# EAGLE schematic main_circuit (EAGLE 9.5.1)
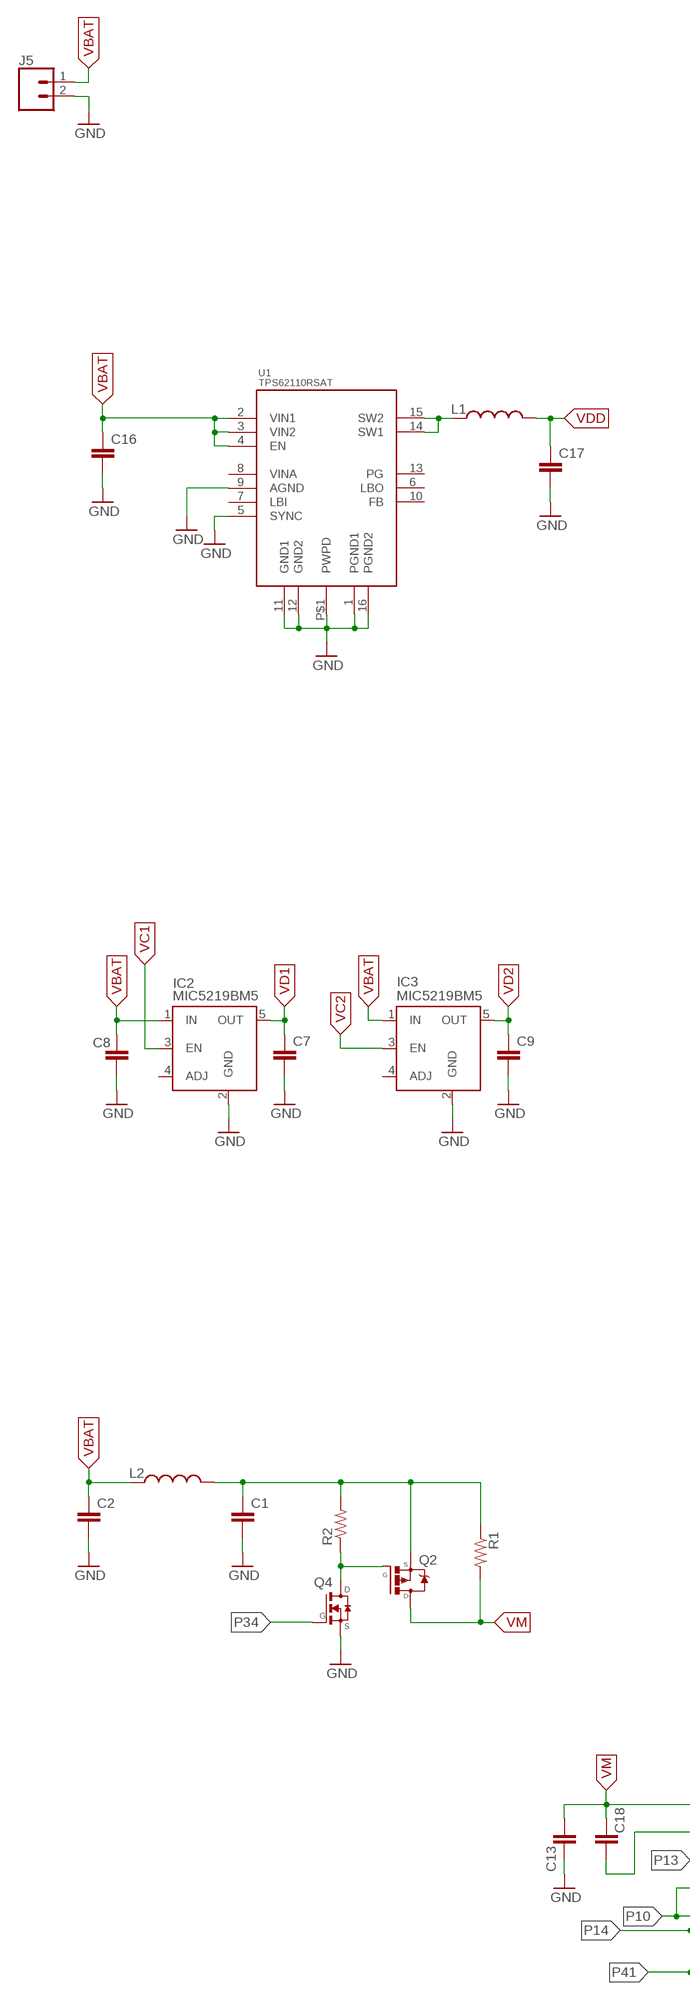
[diagram p0: schematic, sheet 1, part 1 of 2]
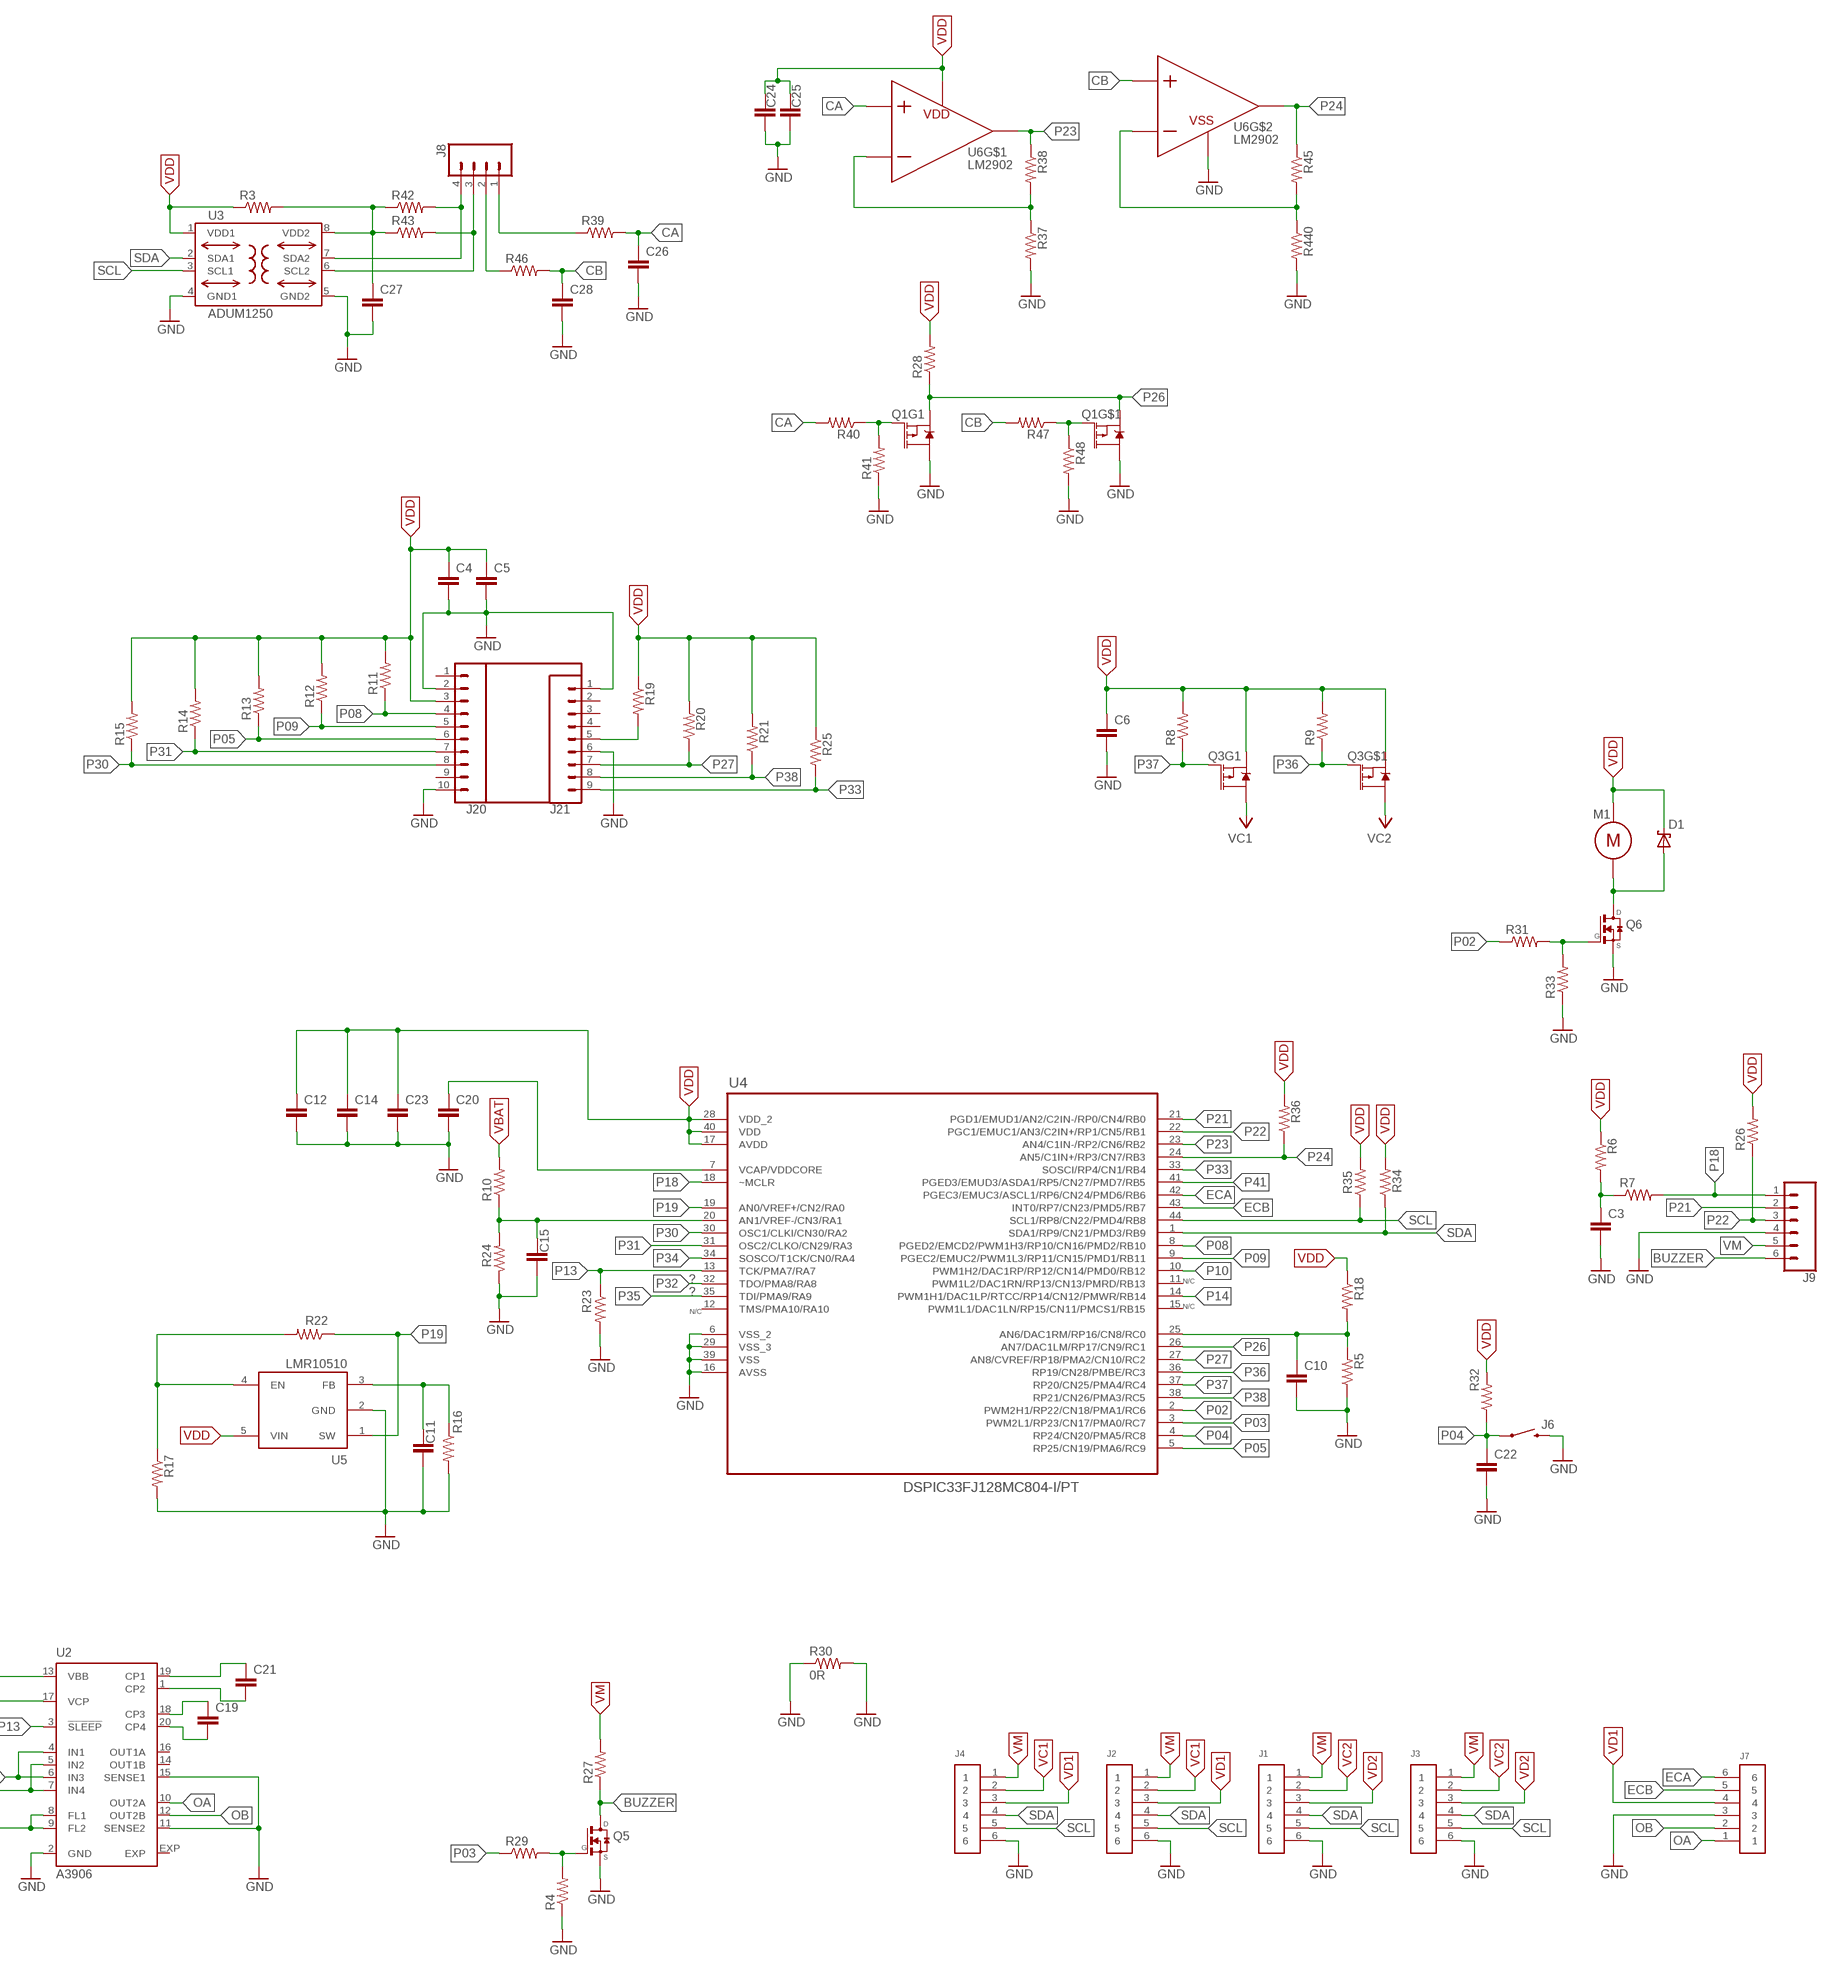
[diagram p1: schematic, sheet 1, part 2 of 2]

## Parts
C1  C-EUC0805  [C0805]
C2  C-EUC0805  [C0805]
C3  CAPACITOR_0805_M  [RESC0805_M]
C4  CAPACITOR_0805_M  [RESC0805_M]
C5  CAPACITOR_0805_M  [RESC0805_M]
C6  C-EUC0805  [C0805]
C7  CAPACITOR_0805_M  [RESC0805_M]
C8  CAPACITOR_0805_M  [RESC0805_M]
C9  CAPACITOR_0805_M  [RESC0805_M]
C10  CAPACITOR_0805_M  [RESC0805_M]
C11  CAPACITOR_0805_M  [RESC0805_M]
C12  CAPACITOR_0805_M  [RESC0805_M]
C13  CAPACITOR_0805_M  [RESC0805_M]
C14  CAPACITOR_0805_M  [RESC0805_M]
C15  CAPACITOR_0805_M  [RESC0805_M]
C16  CAPACITOR_0805_M  [RESC0805_M]
C17  CAPACITOR_0805_M  [RESC0805_M]
C18  CAPACITOR_0805_M  [RESC0805_M]
C19  CAPACITOR_0805_M  [RESC0805_M]
C20  CAPACITOR_0805_M  [RESC0805_M]
C21  CAPACITOR_0805_M  [RESC0805_M]
C22  CAPACITOR_0805_M  [RESC0805_M]
C23  CAPACITOR_0805_M  [RESC0805_M]
C24  CAPACITOR_0805_M  [RESC0805_M]
C25  CAPACITOR_0805_M  [RESC0805_M]
C26  CAPACITOR_0805_M  [RESC0805_M]
C27  CAPACITOR_0805_M  [RESC0805_M]
C28  CAPACITOR_0805_M  [RESC0805_M]
D1  BAS70W,115  [SOT323]
IC2  MIC5219BM5  [SOT23-5]
IC3  MIC5219BM5  [SOT23-5]
J1  61300611121  [61300611121]
J2  61300611121  [61300611121]
J3  61300611121  [61300611121]
J4  61300611121  [61300611121]
J5  CONN_02-JST-2MM-SMT  [JST-2-SMD]
J6  RS032G05A3SM-SPST-MOMENTARY-SWSMD-1101NE  [TACTILE-SWITCH-1101NE]
J7  61300611121  [61300611121]
J8  CONN_04SMD2  [1X04_1MM_RA]
J9  CONN_06SMD-1MM  [1X06-1MM]
J20  CONN_10"  [1X10]
J21  CONN_09  [1X09]
L1  INDUCTOR  [L0603]
L2  INDUCTOR  [L0603]
M1  308-100  [308-100]
Q1  2A/20V/150mΩ  MOSFET_PCH_DUAL-DMP2240UDM  [SOT26]
Q2  FDS6675  [SO08-E3]
Q3  2A/20V/150mΩ  MOSFET_PCH_DUAL-DMP2240UDM  [SOT26]
Q4  FDV303N  [SOT23]
Q5  FDV303N  [SOT23]
Q6  FDV303N  [SOT23]
R1  R-US_M0805  [M0805]
R2  R-US_M0805  [M0805]
R3  R-US_M0805  [M0805]
R4  R-US_M0805  [M0805]
R5  R-US_M0805  [M0805]
R6  R-US_M0805  [M0805]
R7  R-US_M0805  [M0805]
R8  R-US_M0805  [M0805]
R9  R-US_M0805  [M0805]
R10  R-US_M0805  [M0805]
R11  R-US_M0805  [M0805]
R12  R-US_M0805  [M0805]
R13  R-US_M0805  [M0805]
R14  R-US_M0805  [M0805]
R15  R-US_M0805  [M0805]
R16  R-US_R0805  [R0805]
R17  R-US_R0805  [R0805]
R18  R-US_M0805  [M0805]
R19  R-US_M0805  [M0805]
R20  R-US_M0805  [M0805]
R21  R-US_M0805  [M0805]
R22  R-US_R0805  [R0805]
R23  R-US_M0805  [M0805]
R24  R-US_M0805  [M0805]
R25  R-US_M0805  [M0805]
R26  R-US_M0805  [M0805]
R27  R-US_M0805  [M0805]
R28  R-US_M0805  [M0805]
R29  R-US_M0805  [M0805]
R30  0R  R-US_M0805  [M0805]
R31  R-US_M0805  [M0805]
R32  R-US_M0805  [M0805]
R33  R-US_M0805  [M0805]
R34  R-US_M0805  [M0805]
R35  R-US_M0805  [M0805]
R36  R-US_M0805  [M0805]
R37  R-US_M0805  [M0805]
R38  R-US_M0805  [M0805]
R39  R-US_M0805  [M0805]
R40  R-US_M0805  [M0805]
R41  R-US_M0805  [M0805]
R42  R-US_M0805  [M0805]
R43  R-US_M0805  [M0805]
R45  R-US_M0805  [M0805]
R46  R-US_M0805  [M0805]
R47  R-US_M0805  [M0805]
R48  R-US_M0805  [M0805]
R440  R-US_M0805  [M0805]
U1  TPS62110RSAT  [QFN16]
U2  A3906  [QFN20]
U3  ADUM1250  [SO8-COOL]
U4  DSPIC33FJ128MC804-I/PT  [QFP80P1200X1200X120-44N]
U5  LMR10510  LMR10510YMFE/NOPB  [SOT-23-5]
U6  LM2902  [TSSOP8]

## Nets
BUZZER: J9.6 Q5.3(D) R27.1
CA: C26.1 R39.2 R40.2 U6.3(P)
CB: C28.1 R46.2 R47.2 U6.5(P1)
ECA: J7.6 U4.42(PGEC3/EMUC3/ASCL1/RP6/CN24/PMD6/RB6)
ECB: J7.5 U4.43(INT0/RP7/CN23/PMD5/RB7)
GND: C1.2 C2.2 C3.2 C4.2 C5.2 C6.2 C7.2 C8.2 C9.2 C10.2 C11.2 C12.2 C13.1 C14.2 C15.2 C16.2 C17.2 C20.2 C22.2 C23.2 C24.2 C25.2 C26.2 C27.2 C28.2 IC2.2(GND) IC3.2(GND) J1.6 J2.6 J3.6 J4.6 J5.2 J6.2 J7.3 J9.4 J20.2 J20.10 J21.1 J21.6 Q1.D1(D) Q1.D2(D) Q4.2(S) Q5.2(S) Q6.2(S) R4.1 R5.1 R16.2 R17.2 R23.2 R24.1 R30.1 R30.2 R33.1 R37.2 R41.1 R48.2 R440.2 U1.1(PGND1) U1.5(SYNC) U1.9(AGND) U1.11(GND1) U1.12(GND2) U1.16(PGND2) U1.P$1(PWPD) U2.2(GND) U2.11(SENSE2) U2.15(SENSE1) U3.4(GND1) U3.5(GND2) U4.6(VSS_2) U4.16(AVSS) U4.29(VSS_3) U4.39(VSS) U5.2(GND) U6.4(VSS)
N$1: C11.1 R16.1 U5.3(FB)
N$2: R17.1 R22.2 U5.4(EN)
N$3: C1.1 L2.2 Q2.1-3(S) R1.1 R2.2
N$4: Q2.4(G) Q4.3(D) R2.1
N$5: Q6.1(G) R31.2 R33.2
N$6: C3.1 R6.2 R7.1
N$7: D1.1(A) M1.NEG Q6.3(D)
N$8: R45.2 R440.1 U6.6(N1)
N$9: L1.1 U1.14(SW1) U1.15(SW2)
N$11: C18.2 U2.17(VCP)
N$12: C21.2 U2.1(CP2)
N$13: C15.1 R10.1 R24.2 U4.20(AN1/VREF-/CN3/RA1)
N$17: C20.1 U4.7(VCAP/VDDCORE)
N$20: J21.5 R19.2
N$22: C19.1 U2.18(CP3)
N$23: C19.2 U2.20(CP4)
N$24: C21.1 U2.19(CP1)
N$26: R37.1 R38.2 U6.2(N)
N$32: J8.2 R46.1
N$34: J8.1 R39.1
N$36: C10.1 R5.2 R18.2 U4.25(AN6/DAC1RM/RP16/CN8/RC0)
N$37: Q5.1(G) R4.2 R29.2
N$39: C27.1 R3.2 R42.1 R43.1 U3.8(VDD2)
N$44: J8.4 R42.2 U3.7(SDA2)
N$45: J8.3 R43.2 U3.6(SCL2)
N$50: Q1.G1(G) R40.1 R41.2
N$51: Q1.G2(G) R47.1 R48.1
OA: J7.1 U2.10(OUT2A)
OB: J7.2 U2.12(OUT2B)
P02: R31.1 U4.2(PWM2H1/RP22/CN18/PMA1/RC6)
P03: R29.1 U4.3(PWM2L1/RP23/CN17/PMA0/RC7)
P04: C22.1 J6.1 R32.1 U4.4(RP24/CN20/PMA5/RC8)
P05: J20.6 R13.1 U4.5(RP25/CN19/PMA6/RC9)
P08: J20.4 R11.1 U4.8(PGED2/EMCD2/PWM1H3/RP10/CN16/PMD2/RB10)
P09: J20.5 R12.1 U4.9(PGEC2/EMUC2/PWM1L3/RP11/CN15/PMD1/RB11)
P10: U2.4(IN1) U2.6(IN3) U4.10(PWM1H2/DAC1RP/RP12/CN14/PMD0/RB12)
P13: R23.1 U2.3(!SLEEP) U4.13(TCK/PMA7/RA7)
P14: U2.5(IN2) U2.7(IN4) U4.14(PWM1H1/DAC1LP/RTCC/RP14/CN12/PMWR/RB14)
P18: J9.1 R7.2 U4.18(~MCLR)
P19: R22.1 U4.19(AN0/VREF+/CN2/RA0) U5.1(SW)
P21: J9.2 U4.21(PGD1/EMUD1/AN2/C2IN-/RP0/CN4/RB0)
P22: J9.3 R26.1 U4.22(PGC1/EMUC1/AN3/C2IN+/RP1/CN5/RB1)
P23: R38.1 U4.23(AN4/C1IN-/RP2/CN6/RB2) U6.1(VOUT)
P24: R36.1 R45.1 U4.24(AN5/C1IN+/RP3/CN7/RB3) U6.7(VOUT1)
P26: Q1.S1(S) Q1.S2(S) R28.1 U4.26(AN7/DAC1LM/RP17/CN9/RC1)
P27: J21.7 R20.1 U4.27(AN8/CVREF/RP18/PMA2/CN10/RC2)
P30: J20.8 R15.1 U4.30(OSC1/CLKI/CN30/RA2)
P31: J20.7 R14.1 U4.31(OSC2/CLKO/CN29/RA3)
P32: U4.32(TDO/PMA8/RA8)
P33: J21.9 R25.2 U4.33(SOSCI/RP4/CN1/RB4)
P34: Q4.1(G) U4.34(SOSCO/T1CK/CN0/RA4)
P35: U4.35(TDI/PMA9/RA9)
P36: Q3.G2(G) R9.1 U4.36(RP19/CN28/PMBE/RC3)
P37: Q3.G1(G) R8.1 U4.37(RP20/CN25/PMA4/RC4)
P38: J21.8 R21.1 U4.38(RP21/CN26/PMA3/RC5)
P41: U2.8(FL1) U2.9(FL2) U4.41(PGED3/EMUD3/ASDA1/RP5/CN27/PMD7/RB5)
SCL: J1.5 J2.5 J3.5 J4.5 R35.1 U3.3(SCL1) U4.44(SCL1/RP8/CN22/PMD4/RB8)
SDA: J1.4 J2.4 J3.4 J4.4 R34.1 U3.2(SDA1) U4.1(SDA1/RP9/CN21/PMD3/RB9)
VBAT: C2.1 C8.1 C16.1 IC2.1(IN) IC3.1(IN) J5.1 L2.1 R10.2 U1.2(VIN1) U1.3(VIN2) U1.4(EN)
VC1: IC2.3(EN) J2.2 J4.2 Q3.D1(D)
VC2: IC3.3(EN) J1.2 J3.2 Q3.D2(D)
VD1: C7.1 IC2.5(OUT) J2.3 J4.3 J7.4
VD2: C9.1 IC3.5(OUT) J1.3 J3.3
VDD: C4.1 C5.1 C6.1 C12.1 C14.1 C17.1 C23.1 C24.1 C25.1 D1.3(K) J20.3 L1.2 M1.POS Q3.S1(S) Q3.S2(S) R3.1 R6.1 R8.2 R9.2 R11.2 R12.2 R13.2 R14.2 R15.2 R18.1 R19.1 R20.2 R21.2 R25.1 R26.2 R28.2 R32.2 R34.2 R35.2 R36.2 U3.1(VDD1) U4.17(AVDD) U4.28(VDD_2) U4.40(VDD) U5.5(VIN) U6.8(VDD)
VM: C13.2 C18.1 J1.1 J2.1 J3.1 J4.1 J9.5 Q2.5-8(D) R1.2 R27.2 U2.13(VBB)
Unconnected: IC2.4(ADJ) IC3.4(ADJ) J20.1 J20.9 J21.2 J21.3 J21.4 U1.6(LBO) U1.7(LBI) U1.8(VINA) U1.10(FB) U1.13(PG) U2.14(OUT1B) U2.16(OUT1A) U2.EXP U4.11(PWM1L2/DAC1RN/RP13/CN13/PMRD/RB13) U4.12(TMS/PMA10/RA10) U4.15(PWM1L1/DAC1LN/RP15/CN11/PMCS1/RB15)

## Notes on the sheet
- ? | N/C
- ?
- N/C | N/C

## Library data of the parts
C1 C2 C6 = rcl:C-EU: CAPACITOR, European symbol; SPICEPREFIX: C
C3-C5 C7-C28 = Nordic_nRF:CAPACITOR: Generic chip capacitor
D1 = BAS70W_115:BAS70W,115: General-purpose Schottky diode General-purpose Schottky diodes in small Surface-Mounted Device (SMD) plastic packages. AAL Eindhoven MK; AVAILABILITY: Unavailable; DESCRIPTION: Diode Schottky 70V 70mA _DC_ Surface Mount SC-70; MF: Nexperia USA; MP: BAS70W,115; PACKAGE: SOT-323 NXP Semiconductors; PRICE: None
IC2 IC3 = v-reg-micrel:MIC5219BM5: VOLTAGE REGULATOR; MF: ALTERA CORPORATION; MPN: MIC5219BM5 TR; OC_FARNELL: 1100656; OC_NEWARK: 09J8939
J1-J4 J7 = Headers:61300611121: CONN HEADER VERT 6POS 2.54MM Manufacturer's datasheet <https://katalog.we-online.de/em/datasheet/6130xx11121.pdf>; CREATED_BY: PCBLayout.com; DIGI_KEY_PART_NUMBER: 732-5319-ND; MANUFACTURER: Wurth Electronics Inc.; MPN: 61300611121
J5 = SparkFun-Connectors:CONN_02: Multi connection point. Often used as Generic Header-pin footprint for 0.1 inch spaced/style header connections On any of the 0.1 inch spaced packages, you can populate with these: Break Away Headers - Straight <https://www.sparkfun.com/products/116> (PRT-00116) Break Away Male Headers - Right Angle <https://www.sparkfun.com/products/553> (PRT-00553) Female Headers <https://www.sparkfun.com/products/115> (PRT-00115) Break Away Headers - Machine Pin <https://www.sparkfun.com/products/117> (PRT-00117) Break Away Female Headers - Swiss Machine Pin <https://www.sparkfun.com/products/743> (PRT-00743) For SCREWTERMINALS and SPRING TERMINALS visit here: Screw Terimnals on SparkFun.com <https://www.sparkfun.com/search/results?term=Screw+Terminals> (5mm/3.5mm/2.54mm spacing) This device is also useful as a general connection point to wire up your design to another part of your project. Our various solder wires solder well into these plated through hole pads. Hook-Up Wire - Assortment (Stranded, 22 AWG) <https://www.sparkfun.com/products/11375> (PRT-11375) Hook-Up Wire - Assortment (Solid Core, 22 AWG) <https://www.sparkfun.com/products/11367> (PRT-11367) View the entire wire category on our website here <https://www.sparkfun.com/categories/141> Special notes: Molex polarized connector foot print use with: PRT-08233 with associated crimp pins and housings. 2.54_SCREWTERM for use with PRT-10571. 3.5mm Screw Terminal footprints for PRT-08084 5mm Screw Terminal footprints for use with PRT-08432; PROD_ID: CONN-11443
J6 = BeagleBone_Blue_R3:RS032G05A3SM-SPST-MOMENTARY-SW: 6x3.5mm 2-pin Momentary Switch (Push-button) Digikey Link <https://www.digikey.com/products/en?keywords=CKN10388TR-ND> Datasheet <https://media.digikey.com/pdf/Data%20Sheets/C&K/RS-032G05_-SM_RT.pdf>; PROD_ID: SWCH-00815
J8 = SparkFun-Connectors:CONN_04: Multi connection point. Often used as Generic Header-pin footprint for 0.1 inch spaced/style header connections On any of the 0.1 inch spaced packages, you can populate with these: Break Away Headers - Straight <https://www.sparkfun.com/products/116> (PRT-00116) Break Away Male Headers - Right Angle <https://www.sparkfun.com/products/553> (PRT-00553) Female Headers <https://www.sparkfun.com/products/115> (PRT-00115) Break Away Headers - Machine Pin <https://www.sparkfun.com/products/117> (PRT-00117) Break Away Female Headers - Swiss Machine Pin <https://www.sparkfun.com/products/743> (PRT-00743) For SCREWTERMINALS and SPRING TERMINALS visit here: Screw Terimnals on SparkFun.com <https://www.sparkfun.com/search/results?term=Screw+Terminals> (5mm/3.5mm/2.54mm spacing) This device is also useful as a general connection point to wire up your design to another part of your project. Our various solder wires solder well into these plated through hole pads. Hook-Up Wire - Assortment (Stranded, 22 AWG) <https://www.sparkfun.com/products/11375> (PRT-11375) Hook-Up Wire - Assortment (Solid Core, 22 AWG) <https://www.sparkfun.com/products/11367> (PRT-11367) View the entire wire category on our website here <https://www.sparkfun.com/categories/141> Special notes: Molex polarized connector foot print use with SKU : PRT-08231 with associated crimp pins and housings. 1MM SMD Version SKU: PRT-10208; PROD_ID: CONN-10310; SF_ID: PRT-10208
J9 = SparkFun-Connectors:CONN_06: Multi connection point. Often used as Generic Header-pin footprint for 0.1 inch spaced/style header connections On any of the 0.1 inch spaced packages, you can populate with these: Break Away Headers - Straight <https://www.sparkfun.com/products/116> (PRT-00116) Break Away Male Headers - Right Angle <https://www.sparkfun.com/products/553> (PRT-00553) Female Headers <https://www.sparkfun.com/products/115> (PRT-00115) Break Away Headers - Machine Pin <https://www.sparkfun.com/products/117> (PRT-00117) Break Away Female Headers - Swiss Machine Pin <https://www.sparkfun.com/products/743> (PRT-00743) Arduino Stackable Header - 6 Pin <https://www.sparkfun.com/products/9280> (PRT-09280) For SCREWTERMINALS and SPRING TERMINALS visit here: Screw Terimnals on SparkFun.com <https://www.sparkfun.com/search/results?term=Screw+Terminals> (5mm/3.5mm/2.54mm spacing) This device is also useful as a general connection point to wire up your design to another part of your project. Our various solder wires solder well into these plated through hole pads. Hook-Up Wire - Assortment (Stranded, 22 AWG) <https://www.sparkfun.com/products/11375> (PRT-11375) Hook-Up Wire - Assortment (Solid Core, 22 AWG) <https://www.sparkfun.com/products/11367> (PRT-11367) View the entire wire category on our website here <https://www.sparkfun.com/categories/141>; PROD_ID: CONN-08249; SF_ID: GPS-00579
J20 = SparkFun-Connectors:CONN_10: Multi connection point. Often used as Generic Header-pin footprint for 0.1 inch spaced/style header connections On any of the 0.1 inch spaced packages, you can populate with these: Break Away Headers - Straight <https://www.sparkfun.com/products/116> (PRT-00116) Break Away Male Headers - Right Angle <https://www.sparkfun.com/products/553> (PRT-00553) Female Headers <https://www.sparkfun.com/products/115> (PRT-00115) Break Away Headers - Machine Pin <https://www.sparkfun.com/products/117> (PRT-00117) Break Away Female Headers - Swiss Machine Pin <https://www.sparkfun.com/products/743> (PRT-00743) Arduino Stackable Header - 10 Pin <https://www.sparkfun.com/products/11376> (PRT-11376) For SCREWTERMINALS and SPRING TERMINALS visit here: Screw Terimnals on SparkFun.com <https://www.sparkfun.com/search/results?term=Screw+Terminals> (5mm/3.5mm/2.54mm spacing) This device is also useful as a general connection point to wire up your design to another part of your project. Our various solder wires solder well into these plated through hole pads. Hook-Up Wire - Assortment (Stranded, 22 AWG) <https://www.sparkfun.com/products/11375> (PRT-11375) Hook-Up Wire - Assortment (Solid Core, 22 AWG) <https://www.sparkfun.com/products/11367> (PRT-11367) View the entire wire category on our website here <https://www.sparkfun.com/categories/141> Special notes: Molex polarized connector foot print use with SKU : PRT-08231 with associated crimp pins and housings. 1MM SMD Version SKU: PRT-10208 NOTES ON THE VARIANTS LOCK and LOCK_LONGPADS... This footprint was designed to help hold the alignment of a through-hole component (i.e. 6-pin header) while soldering it into place. You may notice that each hole has been shifted either up or down by 0.005 of an inch from it's more standard position (which is a perfectly straight line). This slight alteration caused the pins (the squares in the middle) to touch the edges of the holes. Because they are alternating, it causes a "brace" to hold the component in place. 0.005 has proven to be the perfect amount of "off-center" position when using our standard breakaway headers. Although looks a little odd when you look at the bare footprint, once you have a header in there, the alteration is very hard to notice. Also,if you push a header all the way into place, it is covered up entirely on the bottom side.; PROD_ID: CONN-11563
J21 = SparkFun-Connectors:CONN_09: Multi connection point. Often used as Generic Header-pin footprint for 0.1 inch spaced/style header connections On any of the 0.1 inch spaced packages, you can populate with these: Break Away Headers - Straight <https://www.sparkfun.com/products/116> (PRT-00116) Break Away Male Headers - Right Angle <https://www.sparkfun.com/products/553> (PRT-00553) Female Headers <https://www.sparkfun.com/products/115> (PRT-00115) Break Away Headers - Machine Pin <https://www.sparkfun.com/products/117> (PRT-00117) Break Away Female Headers - Swiss Machine Pin <https://www.sparkfun.com/products/743> (PRT-00743) For SCREWTERMINALS and SPRING TERMINALS visit here: Screw Terimnals on SparkFun.com <https://www.sparkfun.com/search/results?term=Screw+Terminals> (5mm/3.5mm/2.54mm spacing) This device is also useful as a general connection point to wire up your design to another part of your project. Our various solder wires solder well into these plated through hole pads. Hook-Up Wire - Assortment (Stranded, 22 AWG) <https://www.sparkfun.com/products/11375> (PRT-11375) Hook-Up Wire - Assortment (Solid Core, 22 AWG) <https://www.sparkfun.com/products/11367> (PRT-11367) View the entire wire category on our website here <https://www.sparkfun.com/categories/141> Special notes: Molex polarized connector foot print use with SKU : PRT-08231 with associated crimp pins and housings. 1MM SMD Version SKU: PRT-10208 NOTES ON THE VARIANTS LOCK and LOCK_LONGPADS... This footprint was designed to help hold the alignment of a through-hole component (i.e. 6-pin header) while soldering it into place. You may notice that each hole has been shifted either up or down by 0.005 of an inch from it's more standard position (which is a perfectly straight line). This slight alteration caused the pins (the squares in the middle) to touch the edges of the holes. Because they are alternating, it causes a "brace" to hold the component in place. 0.005 has proven to be the perfect amount of "off-center" position when using our standard breakaway headers. Although looks a little odd when you look at the bare footprint, once you have a header in there, the alteration is very hard to notice. Also,if you push a header all the way into place, it is covered up entirely on the bottom side.
L1 L2 = BeagleBone_Blue_R3:INDUCTOR: Inductors Basic Inductor/Choke - 0603 and 1206. Footprints are not proven and vary greatly between part numbers. SRN6045- 33uH, 20% 1.4A
M1 = motor:308-100: Pico Vibe 8mm Vibration Motor - 3mm Type; PRECISION_MICRODRIVES: 308-100
Q1 Q3 = SparkFun-DiscreteSemi:MOSFET_PCH_DUAL: Dual P-Channel -20VDS MOSFET Link to datasheet <http://www.diodes.com/_files/datasheets/ds31197.pdf> SparkFun Products: SparkFun FreeSoC2 Development Board <https://www.sparkfun.com/products/13229>; PROD_ID: TRANS-12444
Q2 = FDS6675BZ:FDS6675: P-Channel MOSFET Logic Level, PowerTrenchTM; AVAILABILITY: Unavailable; DESCRIPTION: P-Channel 30 V 14 mOhm Logic Level PowerTrench Mosfet - SOIC-8; MF: ON Semiconductor; MP: FDS6675; PACKAGE: SOIC-8 Fairchild Semiconductor; PRICE: None
Q4-Q6 = FDV303N:FDV303N: Digital FET, N-Channel; AVAILABILITY: Unavailable; DESCRIPTION: FD V303N Series N-Channel 25 V 0.45 Ohm Surface Mount Digital FET - SOT-23-3; MF: Fairchild Semiconductor; MP: FDV303N.; PACKAGE: SOT-23-3 Fairchild Semiconductor; PRICE: None
R1-R43 R45-R48 R440 = BeagleBone_Black_Wireless:R-US_: RESISTOR, American symbol
U1 = TPS62110RSAT:TPS62110RSAT
U2 = allegro:A3906: Low Voltage Stepper and Single/Dual DC Motor Driver Data Sheet <http://www.allegromicro.com/en/Products/Part_Numbers/3906/3906.pdf>
U3 = ADUM1250:ADUM1250: Hot Swappable, Dual I2C Isolators Source: http://www.analog.com/static/imported-files/data_sheets/ADUM1250_1251.pdf; AVAILABILITY: Unavailable; DESCRIPTION: I²C Digital Isolator 2500Vrms 2 Channel 1Mbps 25kV/µs CMTI 8-SOIC _0.154, 3.90mm Width_; MF: Analog Devices; MP: ADUM1250; PACKAGE: SOIC-8 Analog Devices; PRICE: None
U4 = DSPIC33FJ128MC804-I_PT:DSPIC33FJ128MC804-I/PT: Digital Signal Controllers; AVAILABILITY: Unavailable; DESCRIPTION: dsPIC dsPIC™ 33F Microcontroller IC 16-Bit 40 MIPs 128KB _128K x 8_ FLASH 44-TQFP _10x10_; MF: Microchip; MP: DSPIC33FJ128MC804-I/PT; PACKAGE: TQFP-44 Microchip; PRICE: None
U5 = IC:LMR10510YMFE/NOPB: IC REG BUCK ADJ 1A SOT23-5 Manufacturer's datasheet <http://www.ti.com/general/docs/suppproductinfo.tsp?distId=10&gotoUrl=http%3A%2F%2Fwww.ti.com%2Flit%2Fgpn%2Flmr10510>; CREATED_BY: PCBLayout.com; DIGIKEY_PART_NUMBER: LMR10510YMFE/NOPBTR-ND; MANUFACTURER: Texas Instruments; MPN: LMR10510YMFE/NOPB; PACKAGE: SOT23-5
U6 = LM2902:LM2902